# Altium schematic sheet Visual_LEDx6.SchDoc: Visual LEDx6
size A4
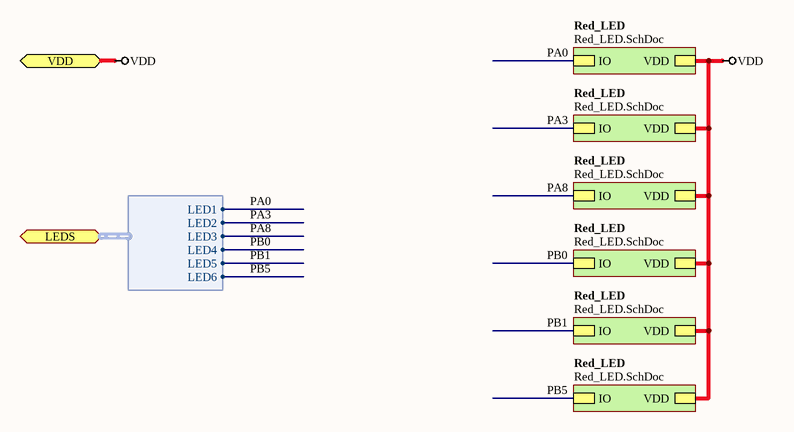
[diagram p0: Visual_LEDx6.SchDoc]

## Sub-sheets
Red_LED = Red_LED.SchDoc: IO, VDD
Red_LED = Red_LED.SchDoc: IO, VDD
Red_LED = Red_LED.SchDoc: IO, VDD
Red_LED = Red_LED.SchDoc: IO, VDD
Red_LED = Red_LED.SchDoc: IO, VDD
Red_LED = Red_LED.SchDoc: IO, VDD

## Ports
LEDS (harness LEDx6), VDD

## Harnesses
LEDx6: LED1, LED2, LED3, LED4, LED5, LED6

## Nets
VDD: port VDD, sheet Red_LED/VDD, sheet Red_LED/VDD, sheet Red_LED/VDD, sheet Red_LED/VDD, sheet Red_LED/VDD, sheet Red_LED/VDD
PA0: sheet Red_LED/IO, port LEDS.LED1
PA3: sheet Red_LED/IO, port LEDS.LED2
PA8: sheet Red_LED/IO, port LEDS.LED3
PB0: sheet Red_LED/IO, port LEDS.LED4
PB1: sheet Red_LED/IO, port LEDS.LED5
PB5: sheet Red_LED/IO, port LEDS.LED6

## Notes on the sheet
- Sheet Title
- Project Title
- Size:
- Date:
- A4
- Item:
- Time:
- Revision:
- Sheet
- of
- File: